# EAGLE design Servo motor controller (EAGLE 9.1.3)
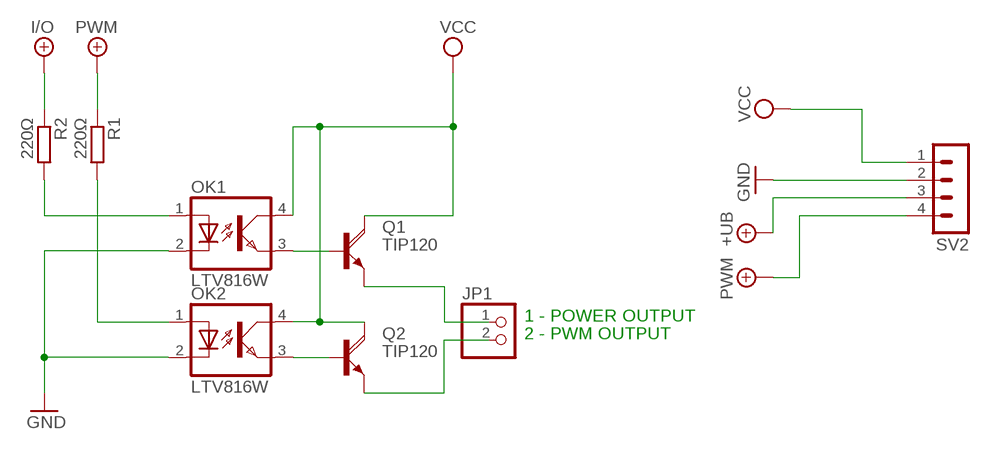
[diagram p0: schematic, sheet 1]

## Parts
JP1  PINHD-1X2  [1X02]
OK1  LTV816W  [DIL4-SMD]
OK2  LTV816W  [DIL4-SMD]
Q1  TIP120  [TO220AH]
Q2  TIP120  [TO220AH]
R1  220Ω  R-EU_0207/10  [0207/10]
R2  220Ω  R-EU_0207/10  [0207/10]
SV2  MA04-1  [MA04-1]

## Nets
+5V/1: R1.1 SV2.4 ; supply symbol labelled PWM
+UB: R2.1 SV2.3 ; supply symbol labelled I/O
GND: OK1.2(C) OK2.2(C) SV2.2
N$1: OK1.3(EMIT) Q1.B
N$2: OK1.1(A) R2.2
N$3: OK2.1(A) R1.2
N$4: OK2.3(EMIT) Q2.B
N$5: JP1.2 Q2.E
N$6: JP1.1 Q1.E
VCC: OK1.4(COL) OK2.4(COL) Q1.C Q2.C SV2.1

## Notes on the sheet
- 1 - POWER OUTPUT
- 2 - PWM OUTPUT

## Library data of the parts
JP1 = pinhead:PINHD-1X2: PIN HEADER
OK1 OK2 = PC357:LTV816: OPTO COUPLER Source: LITEON, LTV816.pdf
Q1 Q2 = Powaaah-transistor:TIP120: NPN DARLINGTON TRANSISTOR
R1 R2 = resistor:R-EU_: RESISTOR, European symbol
SV2 = con-lstb:MA04-1: PIN HEADER; OC_FARNELL: unknown; OC_NEWARK: unknown

## Net classes
0 default: width 1.016 mm, drill 1.016 mm, clearance 1.016 mm

## Board
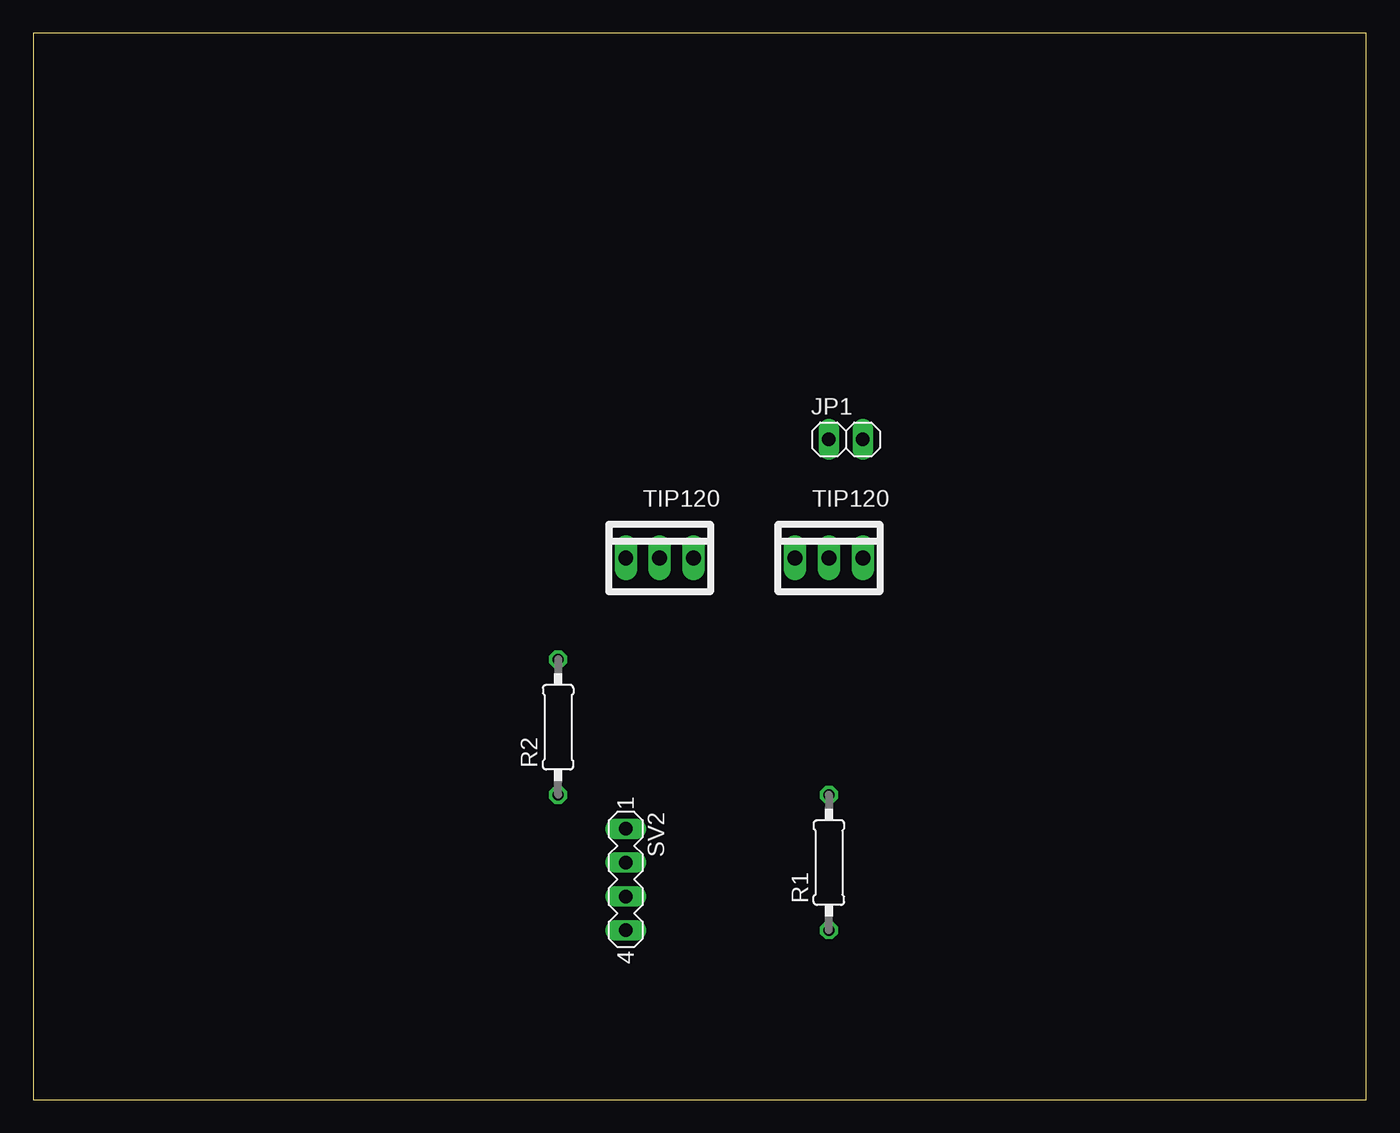
[diagram p1: board, top side]
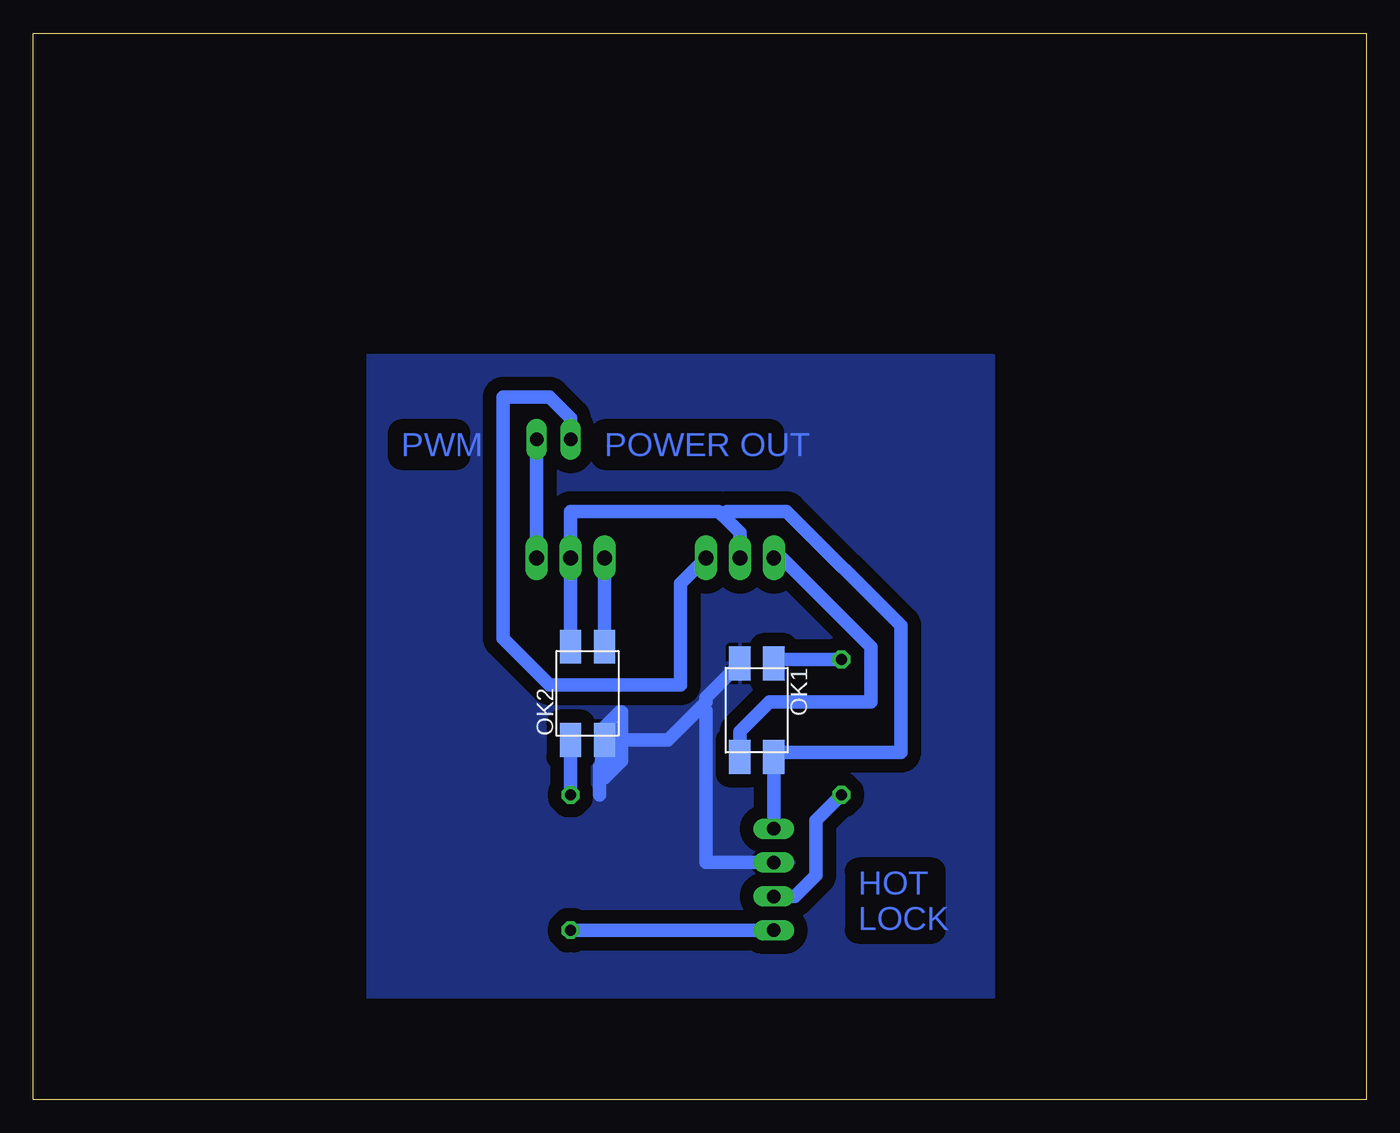
[diagram p2: board, bottom side, seen from below]

Size 100 x 80 mm. Coordinates in mm from the lower left corner, seen from the top.
Outline: 0,0 100,0 100,80 0,80 0,0
Copper layers (1*16): Top 0.035mm / dielectric 1.5mm / Bottom 0.035mm
Design rules "default": minimum track width 6mil, minimum drill 0.35mm, track to track 6mil, track to pad 6mil, pad to pad 6mil, via to via 6mil, smd to smd 6mil, copper to edge 40mil, drill to drill 6mil, minimum pad ring 10mil, minimum via ring 8mil, stop-mask expansion 4mil, vias tented up to drill 0mil, thermal gap 10mil

### Footprints (pad centres in the part's own frame; a part is rotated, then mirrored left to right if it is on the bottom)
1X02 = drill 1.016 long: 1 -1.27,0; 2 1.27,0
DIL4-SMD = smd 1.6 x 2.54: 1 -1.27,-3.5; 2 1.27,-3.5; 3 1.27,3.5; 4 -1.27,3.5
TO220AH = drill 1.118 long: B -2.54,-6.35; C 0,-6.35; E 2.54,-6.35
0207/10 = drill 0.813 octagon: 1 -5.08,0; 2 5.08,0
MA04-1 = drill 1.016 long: 1 -3.81,0; 2 -1.27,0; 3 1.27,0; 4 3.81,0

### Placement (x,y rotation side)
JP1  60.96,49.53 0 top
OK1  45.72,29.21 180 bottom
OK2  58.42,30.48 0 bottom
Q1  46.99,46.99 0 top
Q2  59.69,46.99 0 top
R1  59.69,17.78 90 top
R2  39.37,27.94 90 top
SV2  44.45,16.51 270 top

### Tracks (layer width: path | path; a pad name or v marks a point on that pad's centre or on a via)
+5V/1
  Bottom 1.016: SV2.4 R1.1
+UB
  Bottom 1.016: R2.1 41.27,20.95 41.27,16.83 42.86,15.24 SV2.3
GND
  Bottom 1.016: 49.85,29.53 52.39,26.99 OK2.2 57.15,25.4 | 49.85,29.53 49.53,29.84 49.53,30.16 OK1.2 | SV2.2 49.53,17.78 49.53,29.21 49.85,29.53 | 57.15,25.4 57.15,24.13 55.88,25.4 55.88,26.67 | 55.88,26.67 55.88,27.94 55.88,29.08 56.01,29.08 57.37,27.72 57.37,25.08 57.51,24.94 57.51,22.86 | 55.88,26.67 57.15,25.4
  pour Bottom: 74.93,55.88 27.94,55.88 27.94,7.62 74.93,7.62
N$1
  Bottom 1.016: Q1.B 43.81,40.64 37.15,33.97 37.15,29.84 44.77,29.84 46.99,27.62 OK1.3
N$2
  Bottom 1.016: R2.2 44.45,33.02 OK1.1
N$3
  Bottom 1.016: R1.2 59.69,26.67 OK2.1
N$4
  Bottom 1.016: Q2.B 57.15,34.29 OK2.3
N$5
  Bottom 1.016: Q2.E JP1.2
N$6
  Bottom 1.016: JP1.1 59.69,51.12 61.28,52.7 64.77,52.7 64.77,34.61 61.28,31.11 51.44,31.11 51.44,38.73 Q1.E
VCC
  Bottom 1.016: SV2.1 44.45,25.4 OK1.4 44.13,26.04 34.92,26.04 34.92,35.56 43.5,44.13 47.94,44.13 48.26,43.81 | OK2.4 59.69,34.29 Q2.C 59.69,40.96 59.69,44.13 48.58,44.13 48.26,43.81 | Q1.C 46.99,42.55 48.26,43.81

### Text on the board
Bottom: POWER OUT | PWM | HOT / LOCK